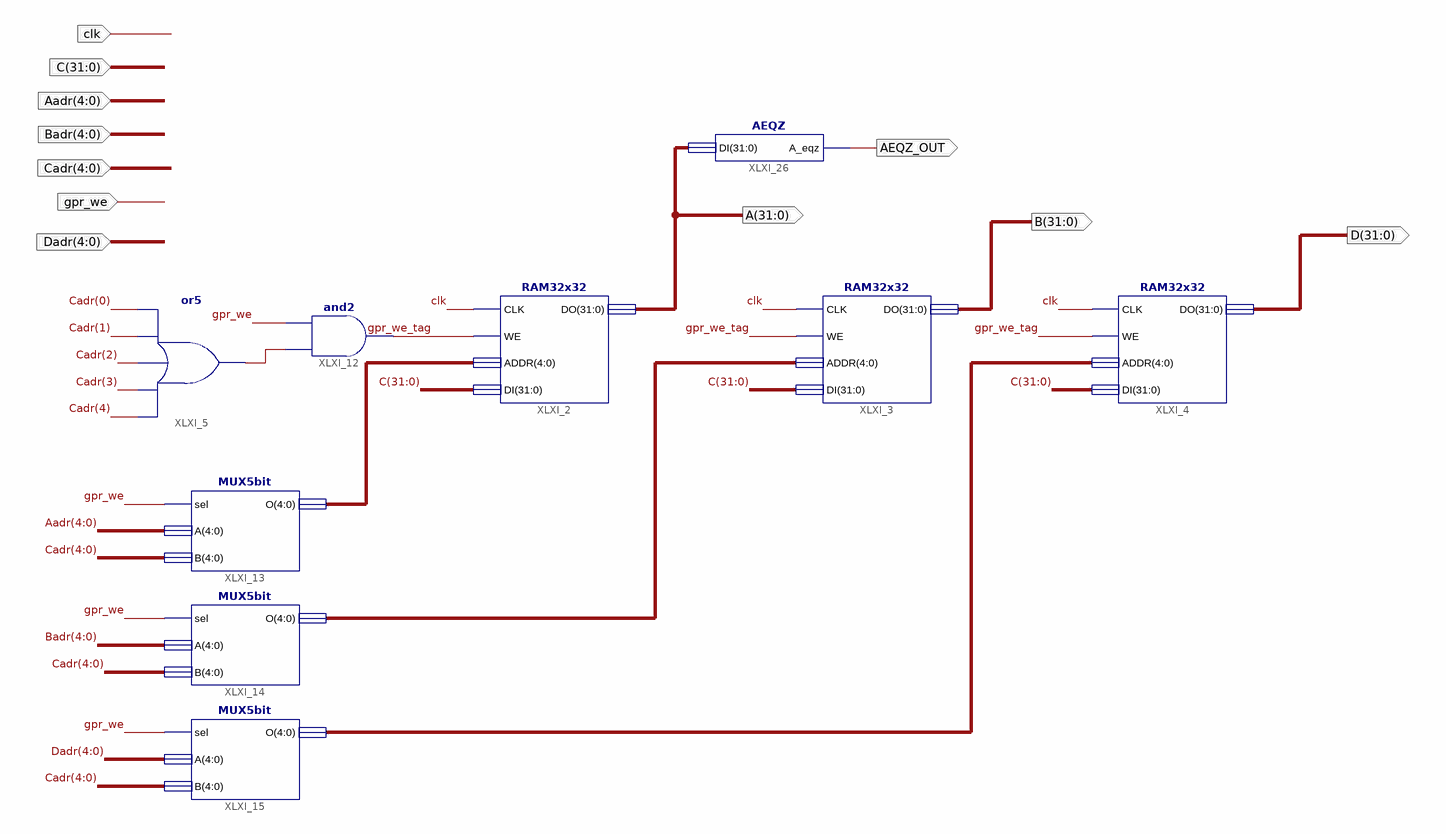
[diagram p0: schematic sheet 1]
// Xilinx ISE schematic GPR_env.sch (artix7) as structural Verilog: 9 symbols, 11 ports
module GPR_env (
  input  [31:0] C,
  input  [4:0] Aadr,
  input  [4:0] Badr,
  input  [4:0] Cadr,
  input  gpr_we,
  input  clk,
  input  [4:0] Dadr,
  output [31:0] B,
  output [31:0] D,
  output [31:0] A,
  output AEQZ_OUT
);

  wire gpr_we_tag, XLXN_17;
  wire [4:0] XLXN_62, XLXN_72, XLXN_73;

  or XLXI_5 (XLXN_17, Cadr[4], Cadr[3], Cadr[2], Cadr[1], Cadr[0]);
  RAM32x32 XLXI_2 (.CLK(clk), .WE(gpr_we_tag), .ADDR(XLXN_62), .DI(C), .DO(A));
  RAM32x32 XLXI_4 (.CLK(clk), .WE(gpr_we_tag), .ADDR(XLXN_73), .DI(C), .DO(D));
  RAM32x32 XLXI_3 (.CLK(clk), .WE(gpr_we_tag), .ADDR(XLXN_72), .DI(C), .DO(B));
  and XLXI_12 (gpr_we_tag, XLXN_17, gpr_we);
  MUX5bit XLXI_14 (.sel(gpr_we), .A(Badr), .B(Cadr), .O(XLXN_72));
  MUX5bit XLXI_15 (.sel(gpr_we), .A(Dadr), .B(Cadr), .O(XLXN_73));
  MUX5bit XLXI_13 (.sel(gpr_we), .A(Aadr), .B(Cadr), .O(XLXN_62));
  AEQZ XLXI_26 (.DI(A), .A_eqz(AEQZ_OUT));
endmodule
